# Altium schematic sheet Power_Supply.SchDoc
size A4
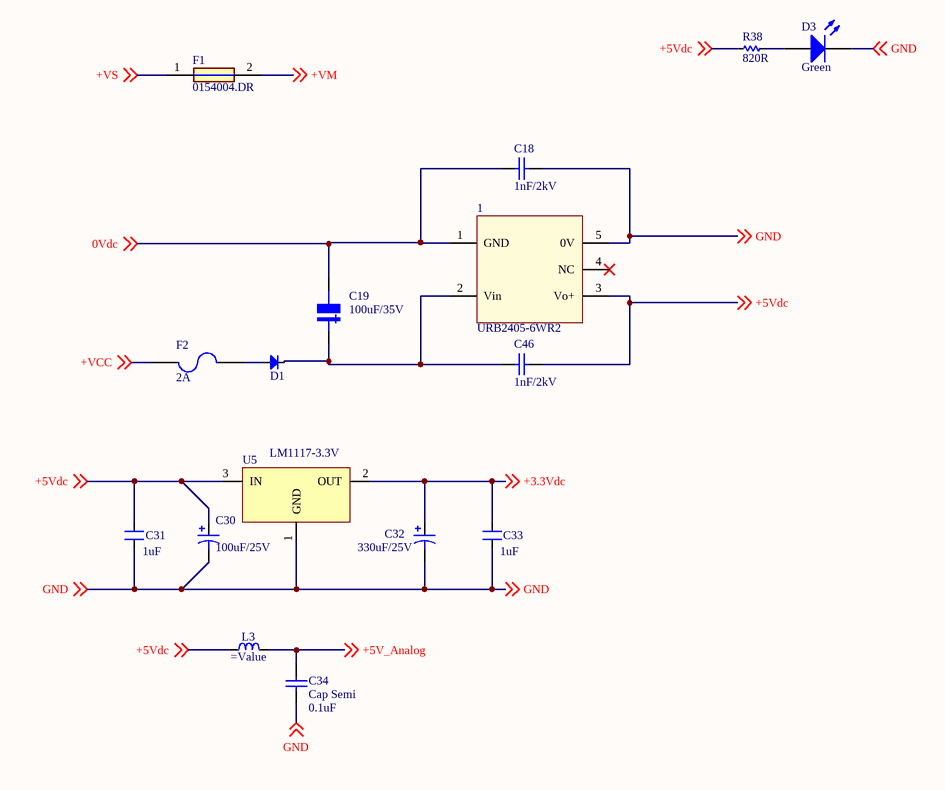
[diagram p0: Power_Supply.SchDoc]

## Parts
1  URB2405-6WR2  [URB2405_6WR2]
C18  1nF/2kV  [Cap 3KV 5mm]
C19  100uF/35V  [tu nhom 10 (g)]
C30  100uF/25V  [Cap size C]
C31  1uF  [CM-0805 capacitor]
C32  330uF/25V  [Cap size C]
C33  1uF  [CM-0805 capacitor]
C34  Cap Semi  value 0.1uF  [CN-SMD-0805]
C46  1nF/2kV  [Cap 3KV 5mm]
D1  Diode SMD  [DIO-SMD-A]  (value not drawn)
D3  Green  [LED-0805-Green]
F1  0154004.DR  [0154001.DRT]
F2  2A  [FUSE_RESETTABLE_SMD_1812]
L3  (no value)  [RES 1206]
R38  820R  [RES-SMD-0805]
U5  LM1117-3.3V  [SOT223]

## Nets
0Vdc: 1.1(GND) C18.1 C19.2 ; off-sheet 0Vdc
+3.3Vdc: C32.1 C33.1 U5.2(OUT) ; off-sheet +3.3Vdc
+5V_Analog: C34.1 L3.2 ; off-sheet +5V_Analog
+5Vdc: 1.3(Vo+) C30.1 C31.1 C46.2 L3.1 R38.1 U5.3(IN) ; off-sheet +5Vdc
+VCC: F2.1 ; off-sheet +VCC
+VM: F1.2 ; off-sheet +VM
+VS: F1.1 ; off-sheet +VS
GND: 1.5(0V) C18.2 C30.2 C31.2 C32.2 C33.2 C34.2 D3.2(K) U5.1(GND) ; off-sheet GND
Net1_2: 1.2(Vin) C19.1 C46.1 D1.2(K)
NetD1_1: D1.1(A) F2.2
NetD3_1: D3.1(A) R38.2

Not connected (* = marked no-connect by the designer): 1 4(NC)*

## Notes on the sheet
- (in symbol Tu Nhom 100uF 35V) +

## Library data of the parts
C18 C46 = Cap: Capacitor; Published: 8-Jun-2000; LatestRevisionDate: 17-Jul-2002; LatestRevisionNote: Re-released for DXP Platform.; PackageReference: RAD-0.3; Publisher: Altium Limited; Value: 1nF/2kV
C19 = Tu Nhom 100uF 35V: Dán; Don_Vi: Con; Ten_Linh_Kien: Tụ Nhôm 100uF 35V; Ma_Hang: MH004019; So_Chan: 2; Chung_Loai: Dán; Kieu_Chan: *
C30 C32 = Cap Pol2: Polarized Capacitor (Axial); Published: 8-Jun-2000; LatestRevisionDate: 17-Jul-2002; LatestRevisionNote: Re-released for DXP Platform.; PackageReference: POLAR0.8; Publisher: Altium Limited
C31 C33 = CN: 0805_SMD_20pF; Value: 100pF
C34 = Cap Semi: Capacitor (Semiconductor SIM Model); Published: 8-Jun-2000; LatestRevisionDate: 29-May-2009; LatestRevisionNote: IPC-7351 Footprint Added.; PackageReference: C1206; Publisher: Altium Limited; PackageDescription: Chip Capacitor
D1 = Diode SMD: Default Diode; Code - JEDEC: DO-214-AB; Value: 1N5007; Published: 8-Jun-2000; Revision: July-2002: Re-released for DXP Platform.; Publisher: Altium Limited
D3 = LED2: Typical RED, GREEN, YELLOW, AMBER GaAs LED; Published: 8-Jun-2000; LatestRevisionDate: 17-Jul-2002; LatestRevisionNote: Re-released for DXP Platform.; PackageVersion: Feb-2002; PackageReference: 3.2X1.6X1.1; Publisher: Altium Limited; PackageDescription: SM LED; 2 Flat Leads
F1 = 0154004.DR: Fuse; Manufacturer_Name: LITTELFUSE; Datasheet Link: http://m.littelfuse.com/~/media/electronics/datasheets/fuses/littelfuse_fuse_154_154t_154l_154tl_datasheet.pdf.pdf; Manufacturer_Part_Number: 0154004.DR; Mouser Part Number: 576-0154004.DR; Mouser Price/Stock: https://www.mouser.co.uk/ProductDetail/Littelfuse/0154004.DR?qs=gu7KAQ731UQeedYeniUNnQ%3D%3D; Arrow Part Number: 0154004.DR; Arrow Price/Stock: https://www.arrow.com/en/products/0154004.dr/littelfuse?region=nac
F2 = Fuse 2: Fuse; Published: 8-Jun-2000; LatestRevisionDate: 17-Jul-2002; LatestRevisionNote: Re-released for DXP Platform.; PackageReference: PIN-W2/E2.8; Publisher: Altium Limited
L3 = Inductor
R38 = Res-SMD: Resistor; Manufacturer: Generic Components; Class: Passive; Published: 08/06/2000; Publisher: Altium Hobart Technology Centre
U5 = LM1117: 800mA Low-Dropout Linear Regulator; Creator: Nguyen Ba Bien; Website: http://group3i.net